# Altium schematic sheet Microcontroller.SchDoc
size A4
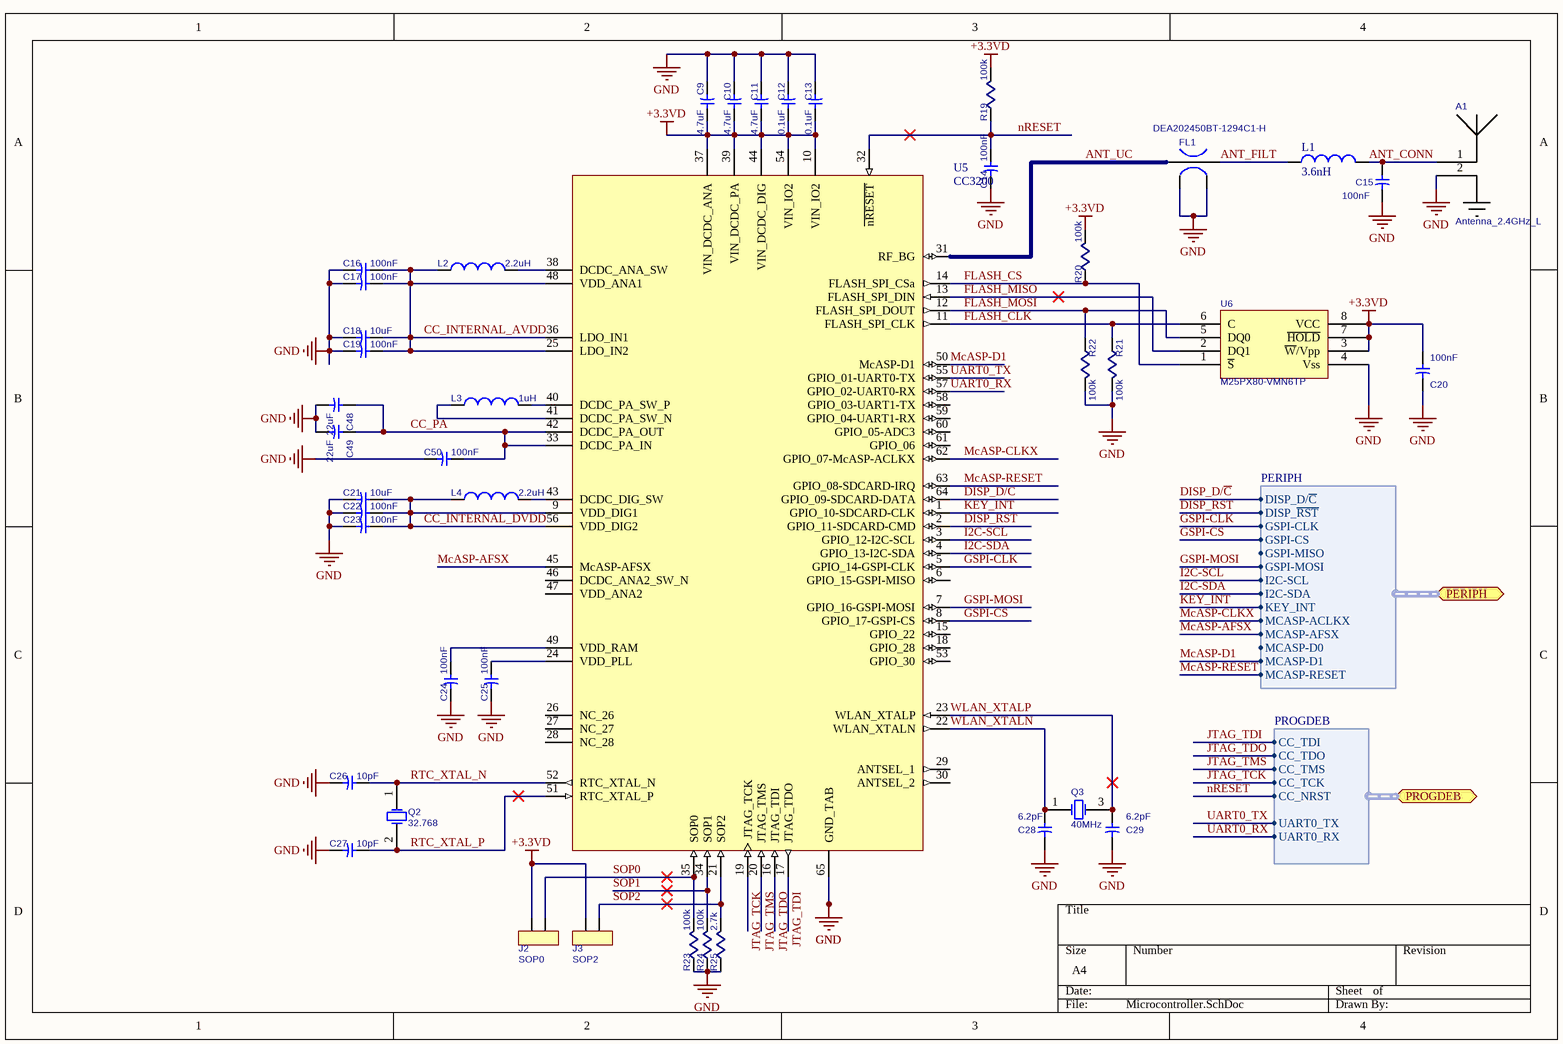
[diagram p0: Microcontroller.SchDoc]

## Parts
A1  Antenna_2.4GHz_L  [Antenna_2.45GHz_IFA1_L]  (net tie, no BOM)
C9  4.7uF  [C_0603A]
C10  4.7uF  [C_0603A]
C11  4.7uF  [C_0603A]
C12  0.1uF  [C_0603A]
C13  0.1uF  [C_0603A]
C14  100nF  [C_0603A]
C15  100nF  [C_0603A]
C16  100nF  [C_0603A]
C17  100nF  [C_0603A]
C18  10uF  [C_0603A]
C19  100nF  [C_0603A]
C20  100nF  [C_0603A]
C21  10uF  [C_0603A]
C22  100nF  [C_0603A]
C23  100nF  [C_0603A]
C24  100nF  [C_0603A]
C25  100nF  [C_0603A]
C26  10pF  [C_0603A]
C27  10pF  [C_0603A]
C28  6.2pF  [C_0603A]
C29  6.2pF  [C_0603A]
C48  22uF  [C_1210D]
C49  22uF  [C_1210D]
C50  100nF  [C_0603A]
FL1  DEA202450BT-1294C1-H  [DEA202450BT-1294C1-H]
J2  SOP0  [JUMPER100]
J3  SOP2  [JUMPER100]
L1  3.6nH  [0402-A]
L2  2.2uH  [L_1008]
L3  1uH  [L_1008]
L4  2.2uH  [L_1008]
Q2  32.768  [Q_FC135]
Q3  40MHz  [SM/25X20/CMOS_CLK_4]
R19  100k  [R_0603]
R20  100k  [R_0603]
R21  100k  [R_0603]
R22  100k  [R_0603]
R23  100k  [R_0603]
R24  100k  [R_0603]
R25  2.7k  [R_0603]
U5  CC3200  [PQFN50P900X900X100_HS-65N]
U6  M25PX80-VMN6TP  [SOG.050/8/WG.244/L.175]

## Ports
PERIPH (harness PERIPH), PROGDEB (harness PROGDEB)

## Harnesses
PROGDEB: CC_TDI, CC_TDO, CC_TCK, CC_TMS, CC_NRST, UART0_TX, UART0_RX
PERIPH: DISP_D/~{C}, DISP_~{RST}, GSPI-CLK, GSPI-CS, GSPI-MISO, GSPI-MOSI, I2C-SCL, I2C-SDA, KEY_INT, MCASP-ACLKX, MCASP-AFSX, MCASP-D0, MCASP-D1, MCASP-RESET

## Nets
+3.3VD: C9.1 C10.1 C11.1 C12.1 C13.1 C20.1 J2.1 J3.1 R19.1 R20.1 U5.10(VIN_IO2) U5.37(VIN_DCDC_ANA) U5.39(VIN_DCDC_PA) U5.44(VIN_DCDC_DIG) U5.54(VIN_IO2) U6.3(~{W}/Vpp) U6.7(~{HOLD}) U6.8(VCC)
GND: A1.2 C9.2 C10.2 C11.2 C12.2 C13.2 C14.2 C15.2 C16.2 C17.2 C18.2 C19.2 C20.2 C21.2 C22.2 C23.2 C24.2 C25.2 C26.2 C27.2 C28.2 C29.2 C48.2 C49.2 C50.2 FL1.2 FL1.4 Q3.2(GND) Q3.4(GND) R21.1 R22.1 R23.2 R24.2 R25.2 U5.65(GND_TAB) U6.4(Vss)
ANT_CONN: A1.1 C15.1 L1.2
ANT_FILT: FL1.3 L1.1
ANT_UC: FL1.1 U5.31(RF_BG)
CC_INTERNAL_AVDD: C16.1 C17.1 C18.1 C19.1 L2.1 U5.25(LDO_IN2) U5.36(LDO_IN1) U5.48(VDD_ANA1)
CC_INTERNAL_DVDD: C21.1 C22.1 C23.1 L4.1 U5.9(VDD_DIG1) U5.56(VDD_DIG2)
CC_PA: C48.1 C49.1 C50.1 U5.33(DCDC_PA_IN) U5.42(DCDC_PA_OUT)
DISP_D/~{C}: U5.64(GPIO_09-SDCARD-DATA) ; port PERIPH.DISP_D/~{C}
DISP_RST: U5.2(GPIO_11-SDCARD-CMD) ; port PERIPH.DISP_~{RST}
FLASH_CLK: R21.2 U5.11(FLASH_SPI_CLK) U6.6(C)
FLASH_CS: R20.2 U5.14(FLASH_SPI_CSa) U6.1(~{S})
FLASH_MISO: U5.13(FLASH_SPI_DIN) U6.2(DQ1)
FLASH_MOSI: R22.2 U5.12(FLASH_SPI_DOUT) U6.5(DQ0)
GSPI-CLK: U5.5(GPIO_14-GSPI-CLK) ; port PERIPH.GSPI-CLK
GSPI-CS: U5.8(GPIO_17-GSPI-CS) ; port PERIPH.GSPI-CS
GSPI-MOSI: U5.7(GPIO_16-GSPI-MOSI) ; port PERIPH.GSPI-MOSI
I2C-SCL: U5.3(GPIO_12-I2C-SCL) ; port PERIPH.I2C-SCL
I2C-SDA: U5.4(GPIO_13-I2C-SDA) ; port PERIPH.I2C-SDA
JTAG_TCK: U5.19(JTAG_TCK) ; port PROGDEB.CC_TCK
JTAG_TDI: U5.17(JTAG_TDO) ; port PROGDEB.CC_TDI
JTAG_TDO: U5.16(JTAG_TDI) ; port PROGDEB.CC_TDO
JTAG_TMS: U5.20(JTAG_TMS) ; port PROGDEB.CC_TMS
KEY_INT: U5.1(GPIO_10-SDCARD-CLK) ; port PERIPH.KEY_INT
McASP-AFSX: U5.45(McASP-AFSX) ; port PERIPH.MCASP-AFSX
McASP-CLKX: U5.62(GPIO_07-McASP-ACLKX) ; port PERIPH.MCASP-ACLKX
McASP-D1: U5.50(McASP-D1) ; port PERIPH.MCASP-D1
McASP-RESET: U5.63(GPIO_08-SDCARD-IRQ) ; port PERIPH.MCASP-RESET
nRESET: C14.1 R19.2 U5.32(~{nRESET}) ; port PROGDEB.CC_NRST
RTC_XTAL_N: C26.1 Q2.1(X1) U5.52(RTC_XTAL_N)
RTC_XTAL_P: C27.1 Q2.2(X2) U5.51(RTC_XTAL_P)
SOP0: J2.2 R23.1 U5.35(SOP0)
SOP1: R24.1 U5.34(SOP1)
SOP2: J3.2 R25.1 U5.21(SOP2)
UART0_RX: U5.57(GPIO_02-UART0-RX) ; port PROGDEB.UART0_RX
UART0_TX: U5.55(GPIO_01-UART0-TX) ; port PROGDEB.UART0_TX
WLAN_XTALN: C28.1 Q3.1(X1) U5.22(WLAN_XTALN)
WLAN_XTALP: C29.1 Q3.3(X2) U5.23(WLAN_XTALP)
NetC24_1: C24.1 U5.49(VDD_RAM)
NetC25_1: C25.1 U5.24(VDD_PLL)
NetL2_2: L2.2 U5.38(DCDC_ANA_SW)
NetL3_1: L3.1 U5.41(DCDC_PA_SW_N)
NetL3_2: L3.2 U5.40(DCDC_PA_SW_P)
NetL4_2: L4.2 U5.43(DCDC_DIG_SW)

Not connected (* = marked no-connect by the designer): U5 6(GPIO_15-GSPI-MISO) 15(GPIO_22) 18(GPIO_28) 26(NC_26) 27(NC_27) 28(NC_28) 29(ANTSEL_1) 30(ANTSEL_2) 46(DCDC_ANA2_SW_N) 47(VDD_ANA2) 53(GPIO_30) 58(GPIO_03-UART1-TX) 59(GPIO_04-UART1-RX) 60(GPIO_05-ADC3) 61(GPIO_06)

## Library data of the parts
C9-C29 C50 = C_0603: PackageReference: C_0603
  C9-C11: VALUE: 4.7uF
  C12 C13: VALUE: 0.1uF
  C14-C17 C19 C20 C22-C25 C50: VALUE: 100nF
  C18 C21: VALUE: 10uF
  C26 C27: VALUE: 10pF
  C28 C29: VALUE: 6.2pF
C48 C49 = C_1210: PackageReference: C_1210; VALUE: 22uF
FL1 = DEA202450BT-1294C1-H: 2.45 GHz filter; Manufacturer: TDK Corporation; Filter Type: Band Pass; Bandwidth: 72MHz; Insertion Loss: 1.35dB; Frequency: 2.45GHz Center; Part Status: Active; Size / Dimension: 0.079" L x 0.053" W (2.00mm x 1.35mm); Supplier Part Number 1: 445-172335-1-ND; Mounting Type: Surface Mount; Package / Case: 0805 (2012 Metric); Supplier 1: Digi-Key; Category: Filters; Manufacturer Part Number: DEA202450BT-1294C1-H; Height (Max): 0.032" (0.80mm); Packaging: Cut Tape (CT); Ripple: -; RoHS: RoHS Compliant
J2 J3 = JUMPER_100: Jumper 2.54 mm
L1 = Inductor: Code_IEC: 1005; Published: 8-Jun-2000; LatestRevisionDate: 29-May-2009; LatestRevisionNote: IPC-7351 Footprint Added.; PackageReference: 0402-A; Publisher: Altium Limited; PackageDescription: Chip Inductor; Code_JEITA: 0402; Value: 3.6nH
L2-L4 = L_1008: Manufacturer Part Number: LQM2HPN2R2MG0L; Manufacturer: Murata Electronics North America; Inductance: 2.2µH; Shielding: Shielded; Frequency - Self Resonant: 40MHz; Type: Multilayer; Frequency - Test: 1MHz; Tolerance: ±20%; Material - Core: Ferrite; Current Rating: 1.3A; DC Resistance (DCR): 100 mOhm Max; RoHS: RoHS Compliant; ComponentLink1URL: http://www.farnell.com/datasheets/1888687.pdf; ComponentLink1Description: http://www.farnell.com/datasheets/1888687.pdf; Supplier Part Number 1: 490-5114-1-ND; Category: Inductors, Coils, Chokes; Height - Seated (Max): 0.039" (1.00mm); Q @ Freq: -; Package / Case: 1008 (2520 Metric); Packaging: Cut Tape (CT); Supplier 1: Digi-Key; Operating Temperature: -55°C ~ 125°C; Current - Saturation: -; Part Status: Active; Ratings: -; Mounting Type: Surface Mount; Size / Dimension: 0.098" L x 0.079" W (2.50mm x 2.00mm); ComponentLink2URL: http://search.murata.co.jp/Ceramy/image/img/PDF/ENG/L0075S0104LQM2HP_G0.pdf; ComponentLink2Description: http://search.murata.co.jp/Ceramy/image/img/PDF/ENG/L0075S0104LQM2HP_G0.pdf
Q2 = QUARTZ_3.2x1.5: Manufacturer Part Number: Q13FC13500003 FC-135 32.768KHZ 9.0PF; Manufacturer: EPSON; Frequency Tolerance + / -: 20; Product Range: FC-135 Series; Load Capacitance: 9; Crystal Case: SMD, 3.2mm x 1.5; Supplier 1: Farnell; Frequency Stability + / -: -; Operating Temperature Max: 85; Packaging: Cut Tape<!--FANDB--><div class="features-and-benefits-container"></div>; RoHS: YES; Frequency Nom: 32.768; Operating Temperature Min: -40; Supplier Part Number 1: 1278037; ComponentLink1Description: http://www.farnell.com/datasheets/1678503.pdf; ComponentLink1URL: http://www.farnell.com/datasheets/1678503.pdf
Q3 = QUARTZ_3.2x2.5: Manufacturer Part Number: Q24FA20H00396  FA-20H 40MHZ 8PF; Manufacturer: EPSON; Load Capacitance: 8; Frequency Nom: 40; Crystal Case: SMD, 2.5mm x 2; Supplier Part Number 1: 2471840; Supplier 1: Farnell; ComponentLink1URL: http://www.farnell.com/datasheets/1897374.pdf; ComponentLink1Description: http://www.farnell.com/datasheets/1897374.pdf
R19-R25 = R_0603: PackageReference: R_0603
  R19-R24: VALUE: 100k
  R25: VALUE: 2.7k
U5 = CC3200: CC3200 Single-Chip Wireless MCU
U6 = M25PX80-VMN6TP: Serial Flash; Manufacturer: Micron Technology Inc.; Manufacturer Part Number: M25PX80-VMN6TP TR; Speed: 75MHz; Voltage - Supply: 2.3 V ~ 3.6 V; Memory Size: 8M (1M x 8); Memory Type: FLASH - NOR; Interface: SPI Serial; Category: Integrated Circuits (ICs); Part Status: Active; Operating Temperature: -40°C ~ 85°C (TA); Package / Case: 8-SOIC (0.154", 3.90mm Width); Supplier Device Package: 8-SO; Packaging: Cut Tape (CT); Format - Memory: FLASH; Supplier 1: Digi-Key; RoHS: RoHS Compliant; ComponentLink1URL: http://www.micron.com/~/media/Documents/Products/Data%20Sheet/NOR%20Flash/Serial%20NOR/M25PX/M25PX_80.pdf; ComponentLink1Description: http://www.micron.com/~/media/Documents/Products/Data%20Sheet/NOR%20Flash/Serial%20NOR/M25PX/M25PX_80.pdf; Supplier Part Number 1: M25PX80-VMN6TP CT-ND